# EAGLE design BatteryModuleBoard (EAGLE 9.6.2)
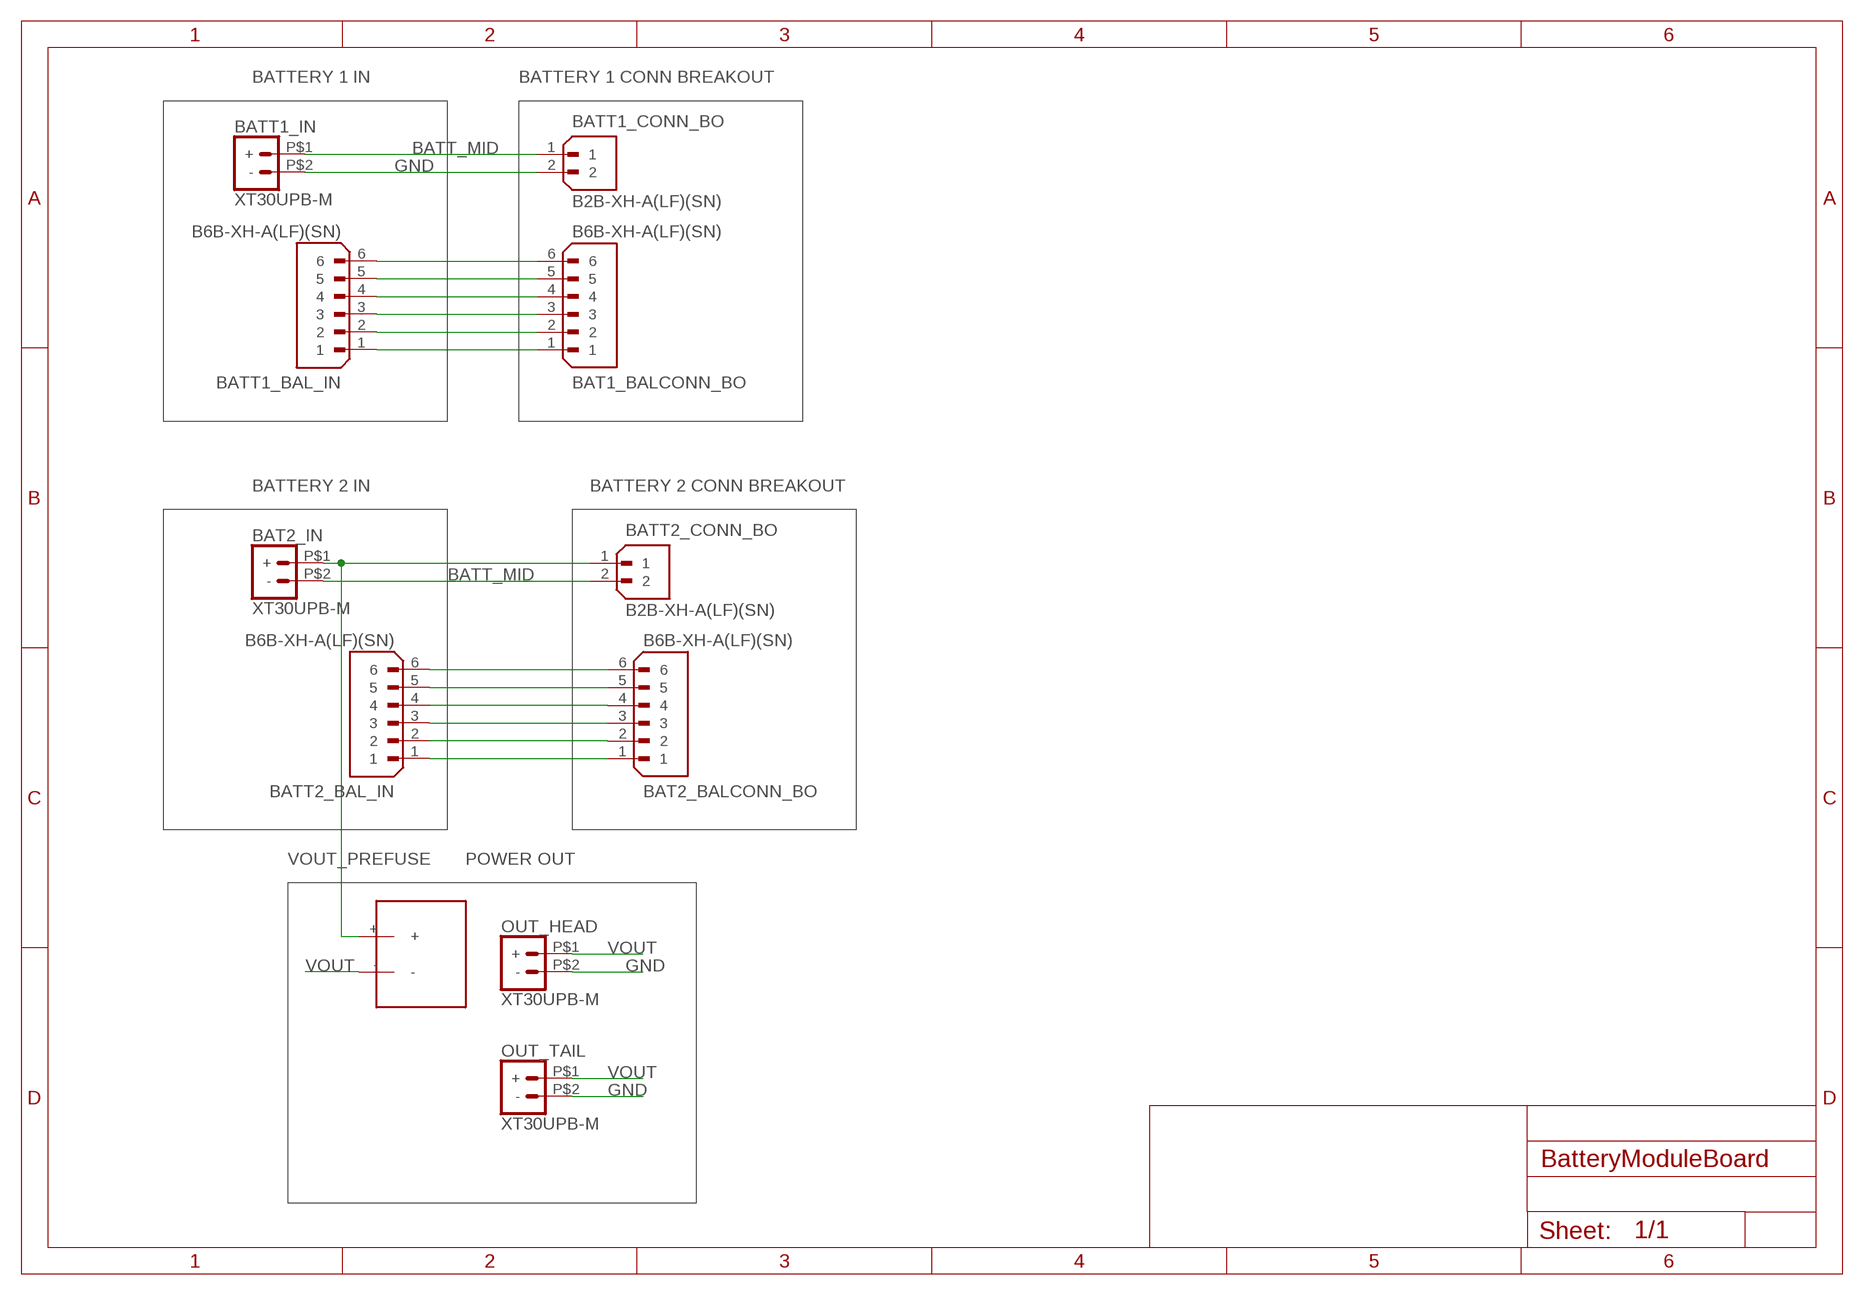
[diagram p0: schematic, sheet 1]

## Parts
BAT1_BALCONN_BO  B6B-XH-A(LF)(SN)  [JST_B6B-XH-A(LF)(SN)]
BAT2_BALCONN_BO  B6B-XH-A(LF)(SN)  [JST_B6B-XH-A(LF)(SN)]
BAT2_IN  XT30UPB-M  [XT30UPB-M]
BATT1_BAL_IN  B6B-XH-A(LF)(SN)  [JST_B6B-XH-A(LF)(SN)]
BATT1_CONN_BO  B2B-XH-A(LF)(SN)  [JST_B2B-XH-A(LF)(SN)]
BATT1_IN  XT30UPB-M  [XT30UPB-M]
BATT2_BAL_IN  B6B-XH-A(LF)(SN)  [JST_B6B-XH-A(LF)(SN)]
BATT2_CONN_BO  B2B-XH-A(LF)(SN)  [JST_B2B-XH-A(LF)(SN)]
FUSE  SETSAFE_C1_FUSE  [SETSAFE_C1_FUSE]
OUT_HEAD  XT30UPB-M  [XT30UPB-M]
OUT_TAIL  XT30UPB-M  [XT30UPB-M]

## Nets
BATT_MID: BAT2_IN.P$2(-) BATT1_CONN_BO.1 BATT1_IN.P$1(+) BATT2_CONN_BO.2
GND: BATT1_CONN_BO.2 BATT1_IN.P$2(-) OUT_HEAD.P$2(-) OUT_TAIL.P$2(-)
N$2: BAT1_BALCONN_BO.6 BATT1_BAL_IN.6
N$3: BAT1_BALCONN_BO.5 BATT1_BAL_IN.5
N$4: BAT1_BALCONN_BO.4 BATT1_BAL_IN.4
N$5: BAT1_BALCONN_BO.3 BATT1_BAL_IN.3
N$6: BAT1_BALCONN_BO.2 BATT1_BAL_IN.2
N$7: BAT1_BALCONN_BO.1 BATT1_BAL_IN.1
N$8: BAT2_BALCONN_BO.6 BATT2_BAL_IN.6
N$9: BAT2_BALCONN_BO.5 BATT2_BAL_IN.5
N$10: BAT2_BALCONN_BO.4 BATT2_BAL_IN.4
N$11: BAT2_BALCONN_BO.3 BATT2_BAL_IN.3
N$12: BAT2_BALCONN_BO.2 BATT2_BAL_IN.2
N$13: BAT2_BALCONN_BO.1 BATT2_BAL_IN.1
VOUT: FUSE.- OUT_HEAD.P$1(+) OUT_TAIL.P$1(+)
VOUT_PREFUSE: BAT2_IN.P$1(+) BATT2_CONN_BO.1 FUSE.+

## Notes on the sheet
- BATTERY 1 IN | BATTERY 1 CONN BREAKOUT
- BATTERY 2 IN | BATTERY 2 CONN BREAKOUT
- POWER OUT

## Library data of the parts
BAT1_BALCONN_BO BAT2_BALCONN_BO BATT1_BAL_IN BATT2_BAL_IN = B6B-XH-A_LF__SN_:B6B-XH-A(LF)(SN): Check availability <https://pricing.snapeda.com/parts/B6B-XH-A%28LF%29%28SN%29/JST%20Sales/view-part?ref=eda>; AVAILABILITY: In Stock; CHECK_PRICES: https://www.snapeda.com/parts/B6B-XH-A(LF)(SN)/JST+Sales+America+Inc./view-part/?ref=eda; DESCRIPTION: Connector Header Through Hole 6 position 0.098 (2.50mm); MF: JST Sales; MP: B6B-XH-A(LF)(SN); PACKAGE: None; PRICE: None; SNAPEDA_LINK: https://www.snapeda.com/parts/B6B-XH-A(LF)(SN)/JST+Sales+America+Inc./view-part/?ref=snap
BAT2_IN BATT1_IN OUT_HEAD OUT_TAIL = XT30UPB-M:XT30UPB-M: Check availability <https://pricing.snapeda.com/parts/XT30UPB-M/amass/view-part?ref=eda>; AVAILABILITY: Not in stock; CHECK_PRICES: https://www.snapeda.com/parts/XT30UPB-M/AMASS/view-part/?ref=eda; DESCRIPTION: Socket; DC supply; XT30; male; PIN: 2; on PCBs; THT; yellow; 15A; 500V; MF: amass; MP: XT30UPB-M; PACKAGE: None; PRICE: None; SNAPEDA_LINK: https://www.snapeda.com/parts/XT30UPB-M/AMASS/view-part/?ref=snap
BATT1_CONN_BO BATT2_CONN_BO = B2B-XH-A_LF__SN_:B2B-XH-A(LF)(SN): Check availability <https://pricing.snapeda.com/parts/B2B-XH-A%28LF%29%28SN%29/JST%20Sales%20America%20Inc./view-part?ref=eda>; AVAILABILITY: In Stock; CHECK_PRICES: https://www.snapeda.com/parts/B2B-XH-A(LF)(SN)/JST+Sales+America+Inc./view-part/?ref=eda; DESCRIPTION: Connector Header Through Hole 2 position 0.098 (2.50mm); MF: JST Sales America Inc.; MP: B2B-XH-A(LF)(SN); PACKAGE: None; PRICE: None; SNAPEDA_LINK: https://www.snapeda.com/parts/B2B-XH-A(LF)(SN)/JST+Sales+America+Inc./view-part/?ref=snap
FUSE = UnderactuatedDorsalFin:SETSAFE_C1_FUSE

## Board
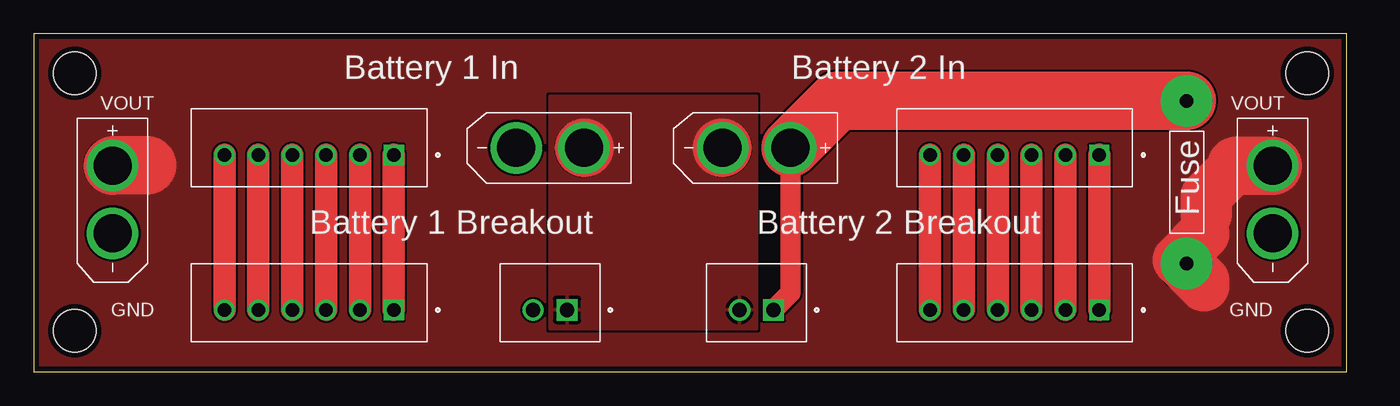
[diagram p1: board, top side]
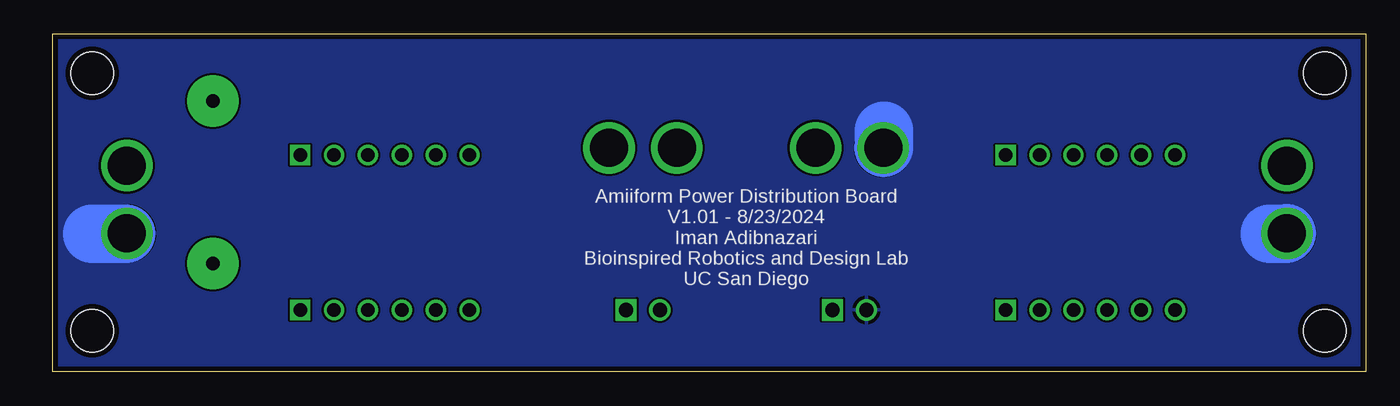
[diagram p2: board, bottom side, seen from below]

Size 96.9 x 24.92 mm. Coordinates in mm from the lower left corner, seen from the top.
Outline: 0,0 96.9,0 96.9,24.92 0,24.92 0,0
Copper layers (1*16): Top 0.035559375mm / dielectric 1.6mm / Bottom 0.035559375mm
Design rules "oshpark-2layer": minimum track width 6mil, minimum drill 10mil, track to track 6mil, track to pad 6mil, pad to pad 6mil, via to via 6mil, smd to smd 6mil, copper to edge 15mil, drill to drill 6mil, minimum pad ring 5mil, minimum via ring 5mil, stop-mask expansion 2.5mil, vias tented up to drill 0mil, thermal gap 10mil
Holes 3.15 mm at 94,3 94,22 3,3 3,22

### Footprints (pad centres in the part's own frame; a part is rotated, then mirrored left to right if it is on the bottom)
JST_B6B-XH-A(LF)(SN) = drill 1 square: 1 6.25,-0.525 | drill 1: 2 3.75,-0.525; 3 1.25,-0.525; 4 -1.25,-0.525; 5 -3.75,-0.525; 6 -6.25,-0.525
XT30UPB-M = drill 2.794: P$1 -2.5,0; P$2 2.5,0
JST_B2B-XH-A(LF)(SN) = drill 1.05 square: 1 1.25,-0.525 | drill 1.05: 2 -1.25,-0.525
SETSAFE_C1_FUSE = drill 1 pad 3.81: + -6,0; - 6,0

### Placement (x,y rotation side)
BAT1_BALCONN_BO  72.39,5.08 0 top
BAT2_BALCONN_BO  20.32,5.08 0 top
BAT2_IN  53.34,16.51 180 top
BATT1_BAL_IN  72.39,16.51 0 top
BATT1_CONN_BO  38.1,5.08 0 top
BATT1_IN  38.1,16.51 180 top
BATT2_BAL_IN  20.32,16.51 0 top
BATT2_CONN_BO  53.34,5.08 0 top
FUSE  85.09,13.97 270 top
OUT_HEAD  91.44,12.7 270 top
OUT_TAIL  5.81,12.7 270 top

### Tracks (layer width: path | path; a pad name or v marks a point on that pad's centre or on a via)
BATT_MID
  Top 4.318: BAT2_IN.P$2 50.8,16.51 | BATT1_IN.P$1 40.64,16.51
  pour Top: 38.1,3.17 38.1,20.32 53.34,20.32 53.34,3.17
GND
  Bottom 3.81: OUT_HEAD.P$2 91.48,10.16
  Bottom 4.318: OUT_TAIL.P$2 5.85,10.16 7.08,10.16 | 91.48,10.16 93.98,10.16 | BATT1_IN.P$2 35.56,16.55 35.56,17.78
  pour Bottom: 0,0 0,25.4 97.79,25.4 97.79,0
N$2
  Top 1.651: BATT1_BAL_IN.6 BAT1_BALCONN_BO.6
N$3
  Top 1.651: BAT1_BALCONN_BO.5 BATT1_BAL_IN.5
N$4
  Top 1.651: BATT1_BAL_IN.4 BAT1_BALCONN_BO.4
N$5
  Top 1.651: BAT1_BALCONN_BO.3 BATT1_BAL_IN.3
N$6
  Top 1.651: BATT1_BAL_IN.2 BAT1_BALCONN_BO.2
N$7
  Top 1.651: BAT1_BALCONN_BO.1 BATT1_BAL_IN.1
N$8
  Top 1.651: BATT2_BAL_IN.6 BAT2_BALCONN_BO.6
N$9
  Top 1.651: BATT2_BAL_IN.5 BAT2_BALCONN_BO.5
N$10
  Top 1.651: BATT2_BAL_IN.4 BAT2_BALCONN_BO.4
N$11
  Top 1.651: BATT2_BAL_IN.3 BAT2_BALCONN_BO.3
N$12
  Top 1.651: BATT2_BAL_IN.2 BAT2_BALCONN_BO.2
N$13
  Top 1.651: BATT2_BAL_IN.1 BAT2_BALCONN_BO.1
VOUT
  Top 3.81: 86.53,11.6 86.53,12.98 88.75,15.2 | FUSE.- 86.36,6.7 86.36,6.35 84.45,8.26 86.36,10.16
  Top 4.318: OUT_HEAD.P$1 88.75,15.2 | OUT_TAIL.P$1 5.85,15.24 8.35,15.24
  pour Top (rank 2): 0,25.4 0,0 97.79,0 97.79,25.4
VOUT_PREFUSE
  Top 1.524: BAT2_IN.P$1 55.84,5.8 BATT2_CONN_BO.1
  Top 4.318: FUSE.+ 59.3,19.97 BAT2_IN.P$1

### Text on the board
tPlace: Battery 1 In | Battery 2 In | Battery 1 Breakout | Battery 2 Breakout
bPlace: Amiiform Power Distribution Board / V1.01 - 8/23/2024 / Iman Adibnazari / Bioinspired Robotics and Design Lab / UC San Diego
tNames: VOUT | VOUT | Fuse | GND | GND